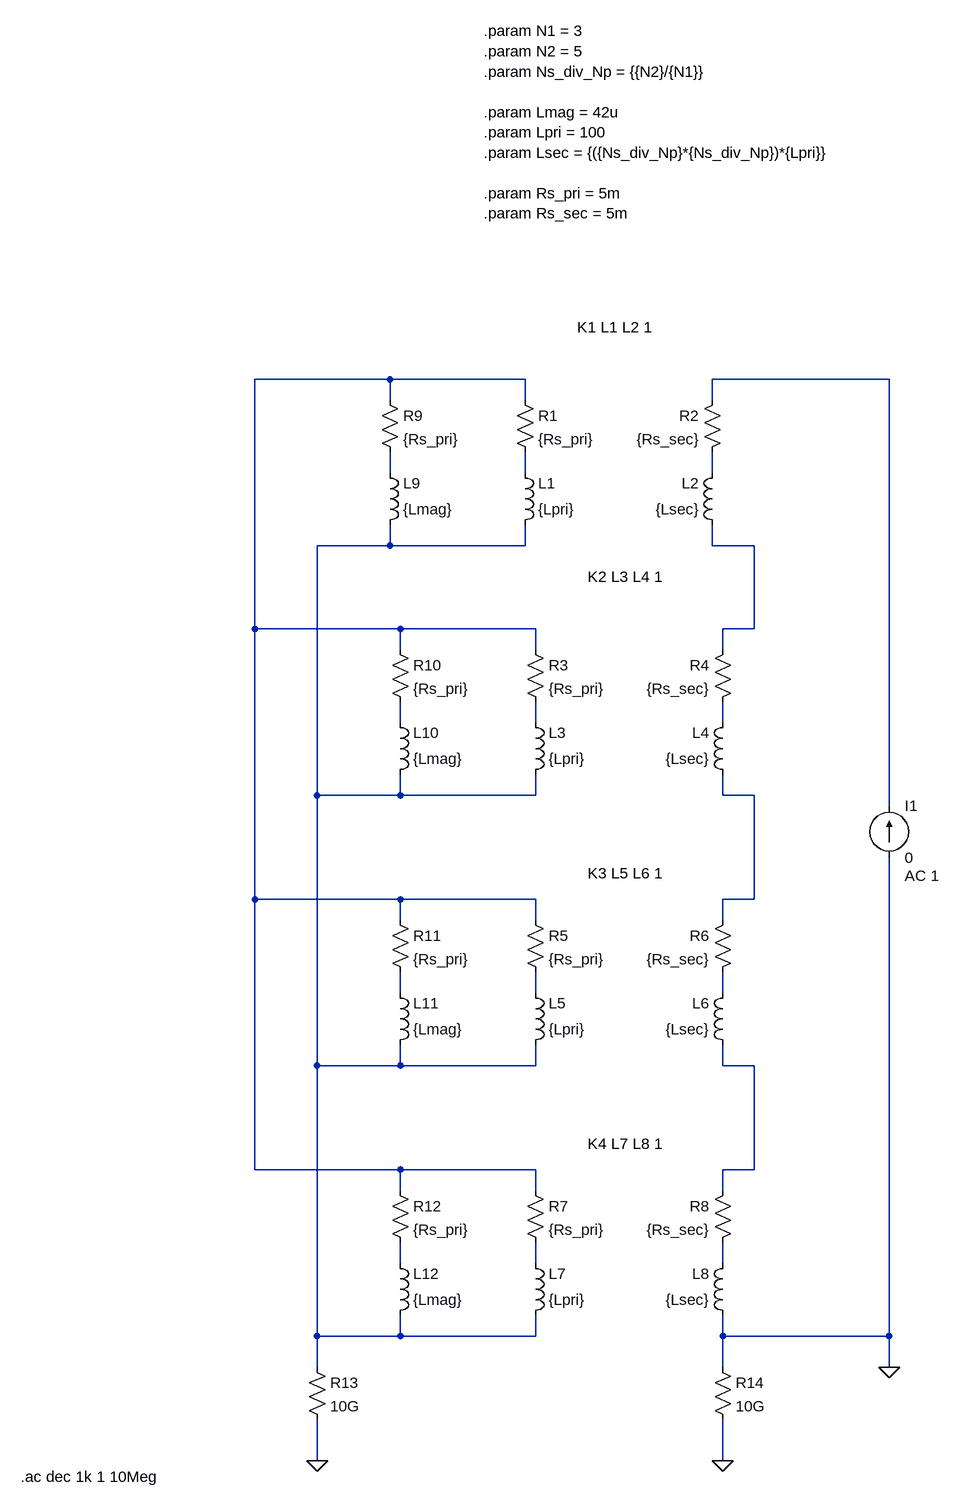
[diagram p0: schematic Transformer.asc]
Transformer.asc, the LTspice schematic file:
Version 4.1
SHEET 1 952 1688
WIRE -32 -16 -240 -16
WIRE 176 -16 -32 -16
WIRE 736 -16 464 -16
WIRE -32 16 -32 -16
WIRE 176 16 176 -16
WIRE 464 16 464 -16
WIRE -32 128 -32 96
WIRE 176 128 176 96
WIRE 464 128 464 96
WIRE -32 240 -32 208
WIRE -32 240 -144 240
WIRE 176 240 176 208
WIRE 176 240 -32 240
WIRE 464 240 464 208
WIRE 528 240 464 240
WIRE -240 368 -240 -16
WIRE -16 368 -240 368
WIRE 192 368 -16 368
WIRE 528 368 528 240
WIRE 528 368 480 368
WIRE -16 400 -16 368
WIRE 192 400 192 368
WIRE 480 400 480 368
WIRE -16 512 -16 480
WIRE 192 512 192 480
WIRE 480 512 480 480
WIRE -144 624 -144 240
WIRE -16 624 -16 592
WIRE -16 624 -144 624
WIRE 192 624 192 592
WIRE 192 624 -16 624
WIRE 480 624 480 592
WIRE 528 624 480 624
WIRE 736 640 736 -16
WIRE -240 784 -240 368
WIRE -16 784 -240 784
WIRE 192 784 -16 784
WIRE 528 784 528 624
WIRE 528 784 480 784
WIRE -16 816 -16 784
WIRE 192 816 192 784
WIRE 480 816 480 784
WIRE -16 928 -16 896
WIRE 192 928 192 896
WIRE 480 928 480 896
WIRE -144 1040 -144 624
WIRE -16 1040 -16 1008
WIRE -16 1040 -144 1040
WIRE 192 1040 192 1008
WIRE 192 1040 -16 1040
WIRE 480 1040 480 1008
WIRE 528 1040 480 1040
WIRE -240 1200 -240 784
WIRE -16 1200 -240 1200
WIRE 192 1200 -16 1200
WIRE 528 1200 528 1040
WIRE 528 1200 480 1200
WIRE -16 1232 -16 1200
WIRE 192 1232 192 1200
WIRE 480 1232 480 1200
WIRE -16 1344 -16 1312
WIRE 192 1344 192 1312
WIRE 480 1344 480 1312
WIRE -144 1456 -144 1040
WIRE -16 1456 -16 1424
WIRE -16 1456 -144 1456
WIRE 192 1456 192 1424
WIRE 192 1456 -16 1456
WIRE 480 1456 480 1424
WIRE 736 1456 736 720
WIRE 736 1456 480 1456
WIRE -144 1504 -144 1456
WIRE 480 1504 480 1456
WIRE 736 1504 736 1456
WIRE -144 1648 -144 1584
WIRE 480 1648 480 1584
FLAG -144 1648 0
FLAG 480 1648 0
FLAG 736 1504 0
SYMBOL ind 160 224 M180
WINDOW 0 36 80 Left 2
WINDOW 3 36 40 Left 2
SYMATTR InstName L1
SYMATTR Value {Lpri}
SYMATTR Type ind
SYMATTR SpiceLine Rser=1m
SYMBOL res 160 0 R0
SYMATTR InstName R1
SYMATTR Value {Rs_pri}
SYMBOL ind 480 224 R180
WINDOW 0 36 80 Left 2
WINDOW 3 36 40 Left 2
SYMATTR InstName L2
SYMATTR Value {Lsec}
SYMATTR Type ind
SYMATTR SpiceLine Rser=1m
SYMBOL res 480 0 M0
SYMATTR InstName R2
SYMATTR Value {Rs_sec}
SYMBOL ind 176 608 M180
WINDOW 0 36 80 Left 2
WINDOW 3 36 40 Left 2
SYMATTR InstName L3
SYMATTR Value {Lpri}
SYMATTR Type ind
SYMATTR SpiceLine Rser=1m
SYMBOL res 176 384 R0
SYMATTR InstName R3
SYMATTR Value {Rs_pri}
SYMBOL ind 496 608 R180
WINDOW 0 36 80 Left 2
WINDOW 3 36 40 Left 2
SYMATTR InstName L4
SYMATTR Value {Lsec}
SYMATTR Type ind
SYMATTR SpiceLine Rser=1m
SYMBOL res 496 384 M0
SYMATTR InstName R4
SYMATTR Value {Rs_sec}
SYMBOL ind 176 1024 M180
WINDOW 0 36 80 Left 2
WINDOW 3 36 40 Left 2
SYMATTR InstName L5
SYMATTR Value {Lpri}
SYMATTR Type ind
SYMATTR SpiceLine Rser=1m
SYMBOL res 176 800 R0
SYMATTR InstName R5
SYMATTR Value {Rs_pri}
SYMBOL ind 496 1024 R180
WINDOW 0 36 80 Left 2
WINDOW 3 36 40 Left 2
SYMATTR InstName L6
SYMATTR Value {Lsec}
SYMATTR Type ind
SYMATTR SpiceLine Rser=1m
SYMBOL res 496 800 M0
SYMATTR InstName R6
SYMATTR Value {Rs_sec}
SYMBOL ind 176 1440 M180
WINDOW 0 36 80 Left 2
WINDOW 3 36 40 Left 2
SYMATTR InstName L7
SYMATTR Value {Lpri}
SYMATTR Type ind
SYMATTR SpiceLine Rser=1m
SYMBOL res 176 1216 R0
SYMATTR InstName R7
SYMATTR Value {Rs_pri}
SYMBOL ind 496 1440 R180
WINDOW 0 36 80 Left 2
WINDOW 3 36 40 Left 2
SYMATTR InstName L8
SYMATTR Value {Lsec}
SYMATTR Type ind
SYMATTR SpiceLine Rser=1m
SYMBOL res 496 1216 M0
SYMATTR InstName R8
SYMATTR Value {Rs_sec}
SYMBOL ind -48 224 M180
WINDOW 0 36 80 Left 2
WINDOW 3 36 40 Left 2
SYMATTR InstName L9
SYMATTR Value {Lmag}
SYMATTR SpiceLine Rser=1m
SYMBOL res -48 0 R0
SYMATTR InstName R9
SYMATTR Value {Rs_pri}
SYMBOL ind -32 608 M180
WINDOW 0 36 80 Left 2
WINDOW 3 36 40 Left 2
SYMATTR InstName L10
SYMATTR Value {Lmag}
SYMATTR SpiceLine Rser=1m
SYMBOL res -32 384 R0
SYMATTR InstName R10
SYMATTR Value {Rs_pri}
SYMBOL ind -32 1024 M180
WINDOW 0 36 80 Left 2
WINDOW 3 36 40 Left 2
SYMATTR InstName L11
SYMATTR Value {Lmag}
SYMATTR SpiceLine Rser=1m
SYMBOL res -32 800 R0
SYMATTR InstName R11
SYMATTR Value {Rs_pri}
SYMBOL ind -32 1440 M180
WINDOW 0 36 80 Left 2
WINDOW 3 36 40 Left 2
SYMATTR InstName L12
SYMATTR Value {Lmag}
SYMATTR SpiceLine Rser=1m
SYMBOL res -32 1216 R0
SYMATTR InstName R12
SYMATTR Value {Rs_pri}
SYMBOL res -160 1488 R0
SYMATTR InstName R13
SYMATTR Value 10G
SYMBOL res 464 1488 R0
SYMATTR InstName R14
SYMATTR Value 10G
SYMBOL current 736 720 M180
WINDOW 0 24 80 Left 2
WINDOW 3 24 0 Left 2
WINDOW 123 24 -28 Left 2
WINDOW 39 0 0 Left 0
SYMATTR InstName I1
SYMATTR Value 0
SYMATTR Value2 AC 1
TEXT 256 -96 Left 2 !K1 L1 L2 1
TEXT 112 -552 Left 2 !.param N1 = 3\n.param N2 = 5\n.param Ns_div_Np = {{N2}/{N1}}\n \n.param Lmag = 42u\n.param Lpri = 100\n.param Lsec = {({Ns_div_Np}*{Ns_div_Np})*{Lpri}}\n \n.param Rs_pri = 5m\n.param Rs_sec = 5m
TEXT 272 288 Left 2 !K2 L3 L4 1
TEXT 272 744 Left 2 !K3 L5 L6 1
TEXT 272 1160 Left 2 !K4 L7 L8 1
TEXT -600 1672 Left 2 !.ac dec 1k 1 10Meg

The netlist it stands for:
* Transformer.asc
L1 N006 N004 {Lpri} Rser=1m
R1 N001 N004 {Rs_pri}
L2 N007 N005 {Lsec} Rser=1m
R2 N002 N005 {Rs_sec}
L3 N006 N009 {Lpri} Rser=1m
R3 N001 N009 {Rs_pri}
L4 N011 N010 {Lsec} Rser=1m
R4 N007 N010 {Rs_sec}
L5 N006 N013 {Lpri} Rser=1m
R5 N001 N013 {Rs_pri}
L6 N015 N014 {Lsec} Rser=1m
R6 N011 N014 {Rs_sec}
L7 N006 N017 {Lpri} Rser=1m
R7 N001 N017 {Rs_pri}
L8 0 N018 {Lsec} Rser=1m
R8 N015 N018 {Rs_sec}
L9 N006 N003 {Lmag} Rser=1m
R9 N001 N003 {Rs_pri}
L10 N006 N008 {Lmag} Rser=1m
R10 N001 N008 {Rs_pri}
L11 N006 N012 {Lmag} Rser=1m
R11 N001 N012 {Rs_pri}
L12 N006 N016 {Lmag} Rser=1m
R12 N001 N016 {Rs_pri}
R13 N006 0 10G
R14 0 0 10G
I1 0 N002 0 AC 1
K1 L1 L2 1
.param N1 = 3
.param N2 = 5
.param Ns_div_Np = {{N2}/{N1}}
.param Lmag = 42u
.param Lpri = 100
.param Lsec = {({Ns_div_Np}*{Ns_div_Np})*{Lpri}}
.param Rs_pri = 5m
.param Rs_sec = 5m
K2 L3 L4 1
K3 L5 L6 1
K4 L7 L8 1
.ac dec 1k 1 10Meg
.backanno
.end